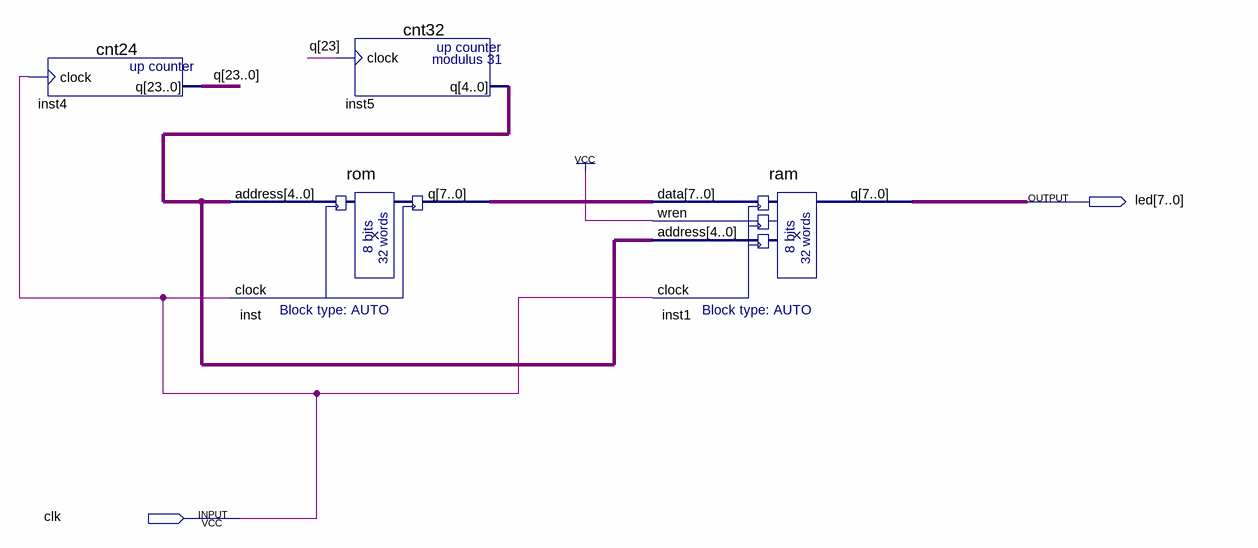
[diagram p0: schematic sheet]
// Quartus schematic 2memory.bdf as structural Verilog: 4 symbols, 2 pins
module \2memory  (
  input  clk,
  output [7:0] led
);

  wire [4:0] inst5_q;
  wire [7:0] inst_q;
  wire [23:0] q;

  cnt24 inst4 (.clock(clk), .q(q));
  rom inst (.address(inst5_q), .clock(clk), .q(inst_q));
  cnt32 inst5 (.clock(q[23]), .q(inst5_q));
  ram inst1 (.data(inst_q), .wren(1'b1), .address(inst5_q), .clock(clk), .q(led));
endmodule
